# Altium schematic sheet cjc.SchDoc
size A4; Organization: Medical Technologies CZ a.s.; SheetNumber: 8; SheetTotal: 10; Version1: N/A; Version2: N/A; Version3: N/A; Change1description: N/A; Change2description: N/A; Change3description: N/A; Change1DrawnBy: N/A; Change2DrawnBy: N/A; Change3DrawnBy: N/A; Change1CheckedBy: N/A; Change2CheckedBy: N/A; Change3CheckedBy: N/A; PreviusVersion_Chng1: N/A; PreviusVersion_Chng2: N/A; PreviusVersion_Chng3: N/A; Variant1description: Standard assembly; Variant2description: N/A; Variant3description: N/A; Variant4description: N/A; PrimaryCard1: XXXxxxXXX; PrimaryCard2: N/A; PrimaryCard3: N/A; PrimaryCard4: N/A; SPICEModelCacheUGHFLKTA: <root> / <DocumentId>UGHFLKTA</DocumentId> / <CacheFrame Number="0"> / <Model Name="cl32b106kbjnnn" Kind="CKT"> / <Text>* CL32B106KBJNNN Multilayer Ceramic Capacitor Spice Model / *----------------------------------------------------------------------------------------------- / * Model Generated by Samsung Electro-Mechanics / * Samsung Spice Model Version 4.0 / * Products : Multilayer Ceramic Capacitor(General) / *----------------------------------------------------------------------------------------------- / * Characteristics : / * / *     Nominal Capacitance = 10uF / *     Capacitance Tolerance = +/-10% / *     TCC = X7R(-55 ~ +125 Cels.) / *     Rated Voltage = 50Vdc / *     Size = 1210(unit:inch), 3225(unit:mm) / *     Length = 3.20 +/-0.30 mm / *     Width = 2.50 +/-0.20 mm / *     Thickness = 2.50 +/-0.20 mm / *     Measurement Temperature : 25Cels. / *     DC bias Value = 0V / *     Frequency : 100Hz ~ 6GHz / *----------------------------------------------------------------------------------------------- / * External Node Assignments : / * / *  1  o---||---o  2 / * / *----------------------------------------------------------------------------------------------- / .SUBCKT CL32B106KBJNNN 1 2 / C1 1 3 9.44968E-06 / C16 17 18 2.53303E-04 / C17 18 19 4.31538E-04 / C18 19 20 3.87143E-03 / C19 20 21 4.05486E-04 / C2 3 4 3.89833E-04 / C20 21 22 2.20709E-04 / C21 22 23 2.77761E-04 / C22 23 24 2.53303E-04 / C23 24 25 1.34605E-05 / C24 25 26 2.30531E-05 / C25 26 27 1.16610E-06 / C26 27 28 4.91406E-11 / C27 28 2 4.09488E-11 / C3 4 5 5.39533E-04 / C4 5 6 5.73260E-04 / C5 6 7 5.11364E-04 / C6 7 8 1.93016E-04 / C7 8 9 1.00000E-10 / C8 9 10 1.00000E-10 / R1 1 3 1.00000E+08 / R11 12 13 2.42949E-02 / R12 13 14 9.10435E-02 / R13 14 15 1.00000E-06 / R14 15 16 1.00000E-06 / R15 16 17 1.00000E-06 / R16 17 18 1.00000E-06 / R17 18 19 7.62309E-04 / R18 19 20 1.20099E-04 / R19 20 21 5.28440E-04 / R2 3 4 3.45620E+00 / R20 21 22 1.50623E-04 / R21 22 23 4.44357E-05 / R22 23 24 1.00000E-06 / R23 24 25 1.36432E-02 / R24 25 26 6.31685E-03 / R25 26 27 1.00465E-02 / R26 27 28 2.29510E+00 / R27 28 2 6.94002E-01 / R3 4 5 3.47991E-01 / R4 5 6 4.97604E-02 / R5 6 7 9.12642E-03 / R6 7 8 2.25502E-03 / R7 8 9 1.00000E-06 / R8 9 10 1.00000E-06 / R9 10 11 1.05460E-03 / L10 11 12 1.83919E-10 / L11 12 13 2.29964E-10 / L12 13 14 6.97785E-11 / L13 14 15 1.00000E-10 / L14 15 16 1.00000E-10 / L15 16 17 1.00000E-10 / L16 17 18 1.00000E-10 / L17 18 19 1.39420E-10 / L18 19 20 1.12292E-11 / L19 20 21 4.19321E-11 / L20 21 22 4.59803E-11 / L21 22 23 1.53628E-11 / L22 23 24 1.00000E-10 / L23 24 25 1.99071E-10 / L24 25 26 4.97469E-11 / L25 26 27 3.21804E-10 / L26 27 28 6.99616E-11 / L27 28 2 2.09205E-11 / .ENDS CL32B106KBJNNN</Text> / </Model> / </CacheFrame> / </root>; DocumentName: Docname
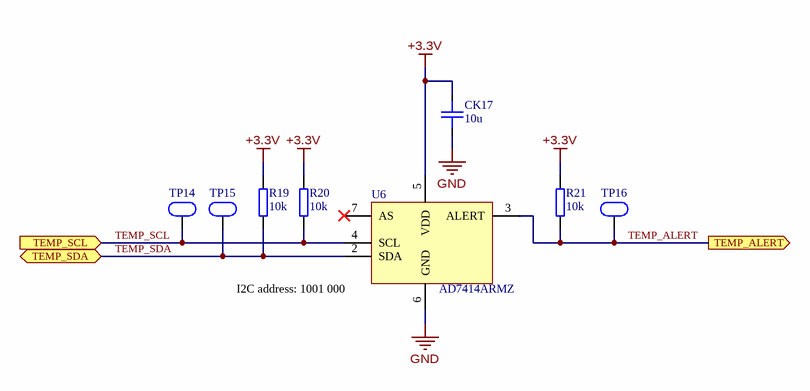
[diagram p0: cjc.SchDoc]

## Parts
CK17  10u  [CAPC3225X27N(SMC1210)]
R19  10k  [RESC2012X06N(SMR0805)]
R20  10k  [RESC2012X06N(SMR0805)]
R21  10k  [RESC2012X06N(SMR0805)]
TP14  Test Point  [SMD_Testpoint_Onelayer]  (value not drawn)
TP15  Test Point  [SMD_Testpoint_Onelayer]  (value not drawn)
TP16  Test Point  [SMD_Testpoint_Onelayer]  (value not drawn)
U6  AD7414ARMZ  [RM_8(MSOP-8)]

## Ports
TEMP_ALERT (out), TEMP_SCL (in), TEMP_SDA (bidir)

## Nets
+3.3V: CK17.1 R19.2 R20.2 R21.2 U6.5(VDD)
GND: CK17.2 U6.6(GND)
TEMP_ALERT: R21.1 TP16.1 U6.3(ALERT) ; port TEMP_ALERT
TEMP_SCL: R20.1 TP14.1 U6.4(SCL) ; port TEMP_SCL
TEMP_SDA: R19.1 TP15.1 U6.2(SDA) ; port TEMP_SDA

Not connected (* = marked no-connect by the designer): U6 7(AS)*

## Notes on the sheet
- (near U6) I2C address: 1001 000
- Číslo výkresu /drawing number/:
- Nazev listu/sheet name/:
- DPS projekt/PCB project/:
- Kreslil /drawn by/ :
- Kontroloval /checked by/:
- Datum /date/:
- List /sheet/:
- /

## Library data of the parts
CK17 = ECK+10U50VXX0: C; 10u; 50V; 10%; X7R; ??;; Manufacturer: Murata: GRM32ER71H106KA12L;;Samsung Electro-mechanics: CL32B106KBJNNNE; Note: X7R, 9uF @ 10V, 5uF @ 30V, 2.5uF @ 50V; Component_Class: Capacitor; Status_I: Production; Status_II: Active; Tolerance_Pct: 10; Voltage_Rating_V: 50; Capacitance_F: 1E-5; KK: ECK+10U50VXX0; Value: 10u; SMD: 1; ComponentLink2URL: I:\DataSheets\ECK+10U50VXX0_MurataEN100.pdf; ComponentLink2Description: ECK+10U50VXX0_MurataEN100.pdf; ComponentLink3URL: I:\DataSheets\ECK+10U50VXX0_SamsungEN100.pdf; ComponentLink3Description: ECK+10U50VXX0_SamsungEN100.pdf; Dielectric_Type: X7R; ComponentLink1URL: heliosgreen://v1/hegMT/5-MT/Classes(343)/Folders/OpenForm?RecordNumbers=[10658879]; ComponentLink1Description: Helios
R19-R21 = ER+10K0.1WXXF: R; 10k; 0.125W; 1%; 150V; Thick Film; ±100ppm/K; 1x;; Manufacturer: VISHAY: CRCW0805 10KOHM TK100 1%;;AVX: CR21-1002F-T;;BC Components: MCU0805-50 1% P5 10k;;YAGEO: RC0805FR-0710KL;;PANASONIC: ERJ 6EN F 1002 V;;HaS Lanskroun: CMF0805 10k 1% 100ppm/K;;ASJ: CR21-1002-FL; Component_Class: Resistor; Status_I: Production; Status_II: Active; Tolerance_Pct: 1; Voltage_Rating_V: 150; Resistance_Ohm: 10000; Power_Rating_W: 0.125; Temperature_Coefficient_PPMpK: ±100; KK: ER+10K0.1WXXF; Value: 10k; SMD: 1; ComponentLink2URL: i:\DataSheets\ER+0.1WXXF_Yageo.pdf; ComponentLink2Description: ER+0.1WXXF_Yageo.pdf; Multiplicity: 1; Resistor_Type: Thick Film; ComponentLink1URL: heliosgreen://v1/hegMT/5-MT/Classes(343)/Folders/OpenForm?RecordNumbers=[381481]; ComponentLink1Description: Helios
TP14-TP16 = EJ+TESTPOINTXX0: Con; Test Point; 1x; PCB; ??; ??V; ??A; ??; Tin; Contact;; Manufacturer: Harwin: S1751-46R; Component_Class: Connector; Status_I: Production; Status_II: Active; Multiplicity: 1; KK: EJ+TESTPOINTXX0; Value: Test Point; SMD: 1; ComponentLink2URL: i:\datasheets\EJ+TESTPOINTXX0_HarwinEN100.pdf; ComponentLink2Description: EJ+TESTPOINTXX0_HarwinEN100.pdf; ComponentLink3URL: i:\datasheets\EJ+TESTPOINTXX0_BoardWareEN100.pdf; ComponentLink3Description: EJ+TESTPOINTXX0_BoardWareEN100.pdf; Mounting_Style: PCB; Connector_Family: Test Point; Plating: Tin; Connector_Part: Contact; ComponentLink1URL: heliosgreen://v1/hegMT/5-MT/Classes(343)/Folders/OpenForm?RecordNumbers=[5618398]; ComponentLink1Description: Helios; System: Connector
U6 = EU+AD7414ARMZXX0: Sen; Temperature [°C]; Digital/PWM; 0.5%;; Manufacturer: ANALOG DEVICES: AD7414ARMZ-0;;ANALOG DEVICES: AD7414ARMZ-0REEL7; Component_Class: Sensor; Status_I: Production; Status_II: Active; Tolerance_Pct: 0.5; KK: EU+AD7414ARMZXX0; Value: AD7414ARMZ; SMD: 1; ComponentLink2URL: i:\datasheets\EU+AD7414ARMZXX0_ADEN100.pdf; ComponentLink2Description: EU+AD7414ARMZXX0_ADEN100.pdf; Physical_Quantity: Temperature [°C]; Sensor_Output: Digital/PWM; ComponentLink1URL: heliosgreen://v1/hegMT/5-MT/Classes(343)/Folders/OpenForm?RecordNumbers=[7785359]; ComponentLink1Description: Helios